# EAGLE schematic lcdmount (EAGLE 6.0)
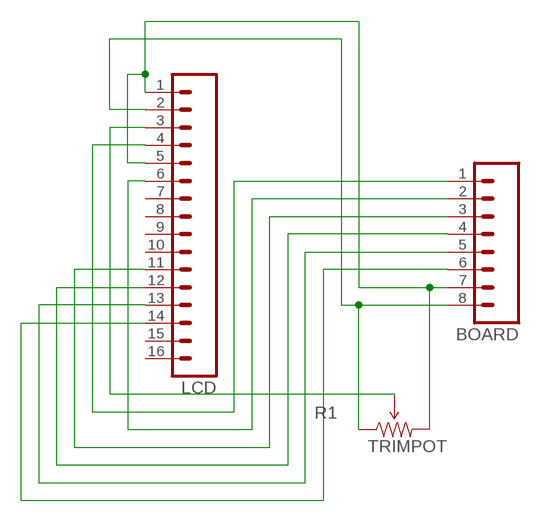
[diagram p0: schematic, sheet 1]

## Parts
BOARD  M081X08  [1X08]
LCD  M16PTH  [1X16]
R1  TRIMPOT  [3362U-2]

## Nets
N$1: BOARD.7 LCD.1 LCD.5 R1.3(CW)
N$2: BOARD.8 LCD.2 R1.1(CCW)
N$3: LCD.3 R1.2(WIPER)
N$4: BOARD.1 LCD.4
N$5: BOARD.3 LCD.11
N$6: BOARD.2 LCD.6
N$7: BOARD.4 LCD.12
N$8: BOARD.5 LCD.13
N$9: BOARD.6 LCD.14
Unconnected: LCD.7 LCD.8 LCD.9 LCD.10 LCD.15 LCD.16

## Library data of the parts
BOARD = SparkFun:M08: Header 8 Standard 8-pin 0.1" header. Use with straight break away headers (SKU : PRT-00116), right angle break away headers (PRT-00553), swiss pins (PRT-00743), machine pins (PRT-00117), and female headers (PRT-00115).
LCD = SparkFun-Connectors:M16: 1x16 .1" header
R1 = SparkFun:TRIMPOT